# Altium schematic sheet D_INPUT.SchDoc
size A; SheetNumber: 2; SheetTotal: 5
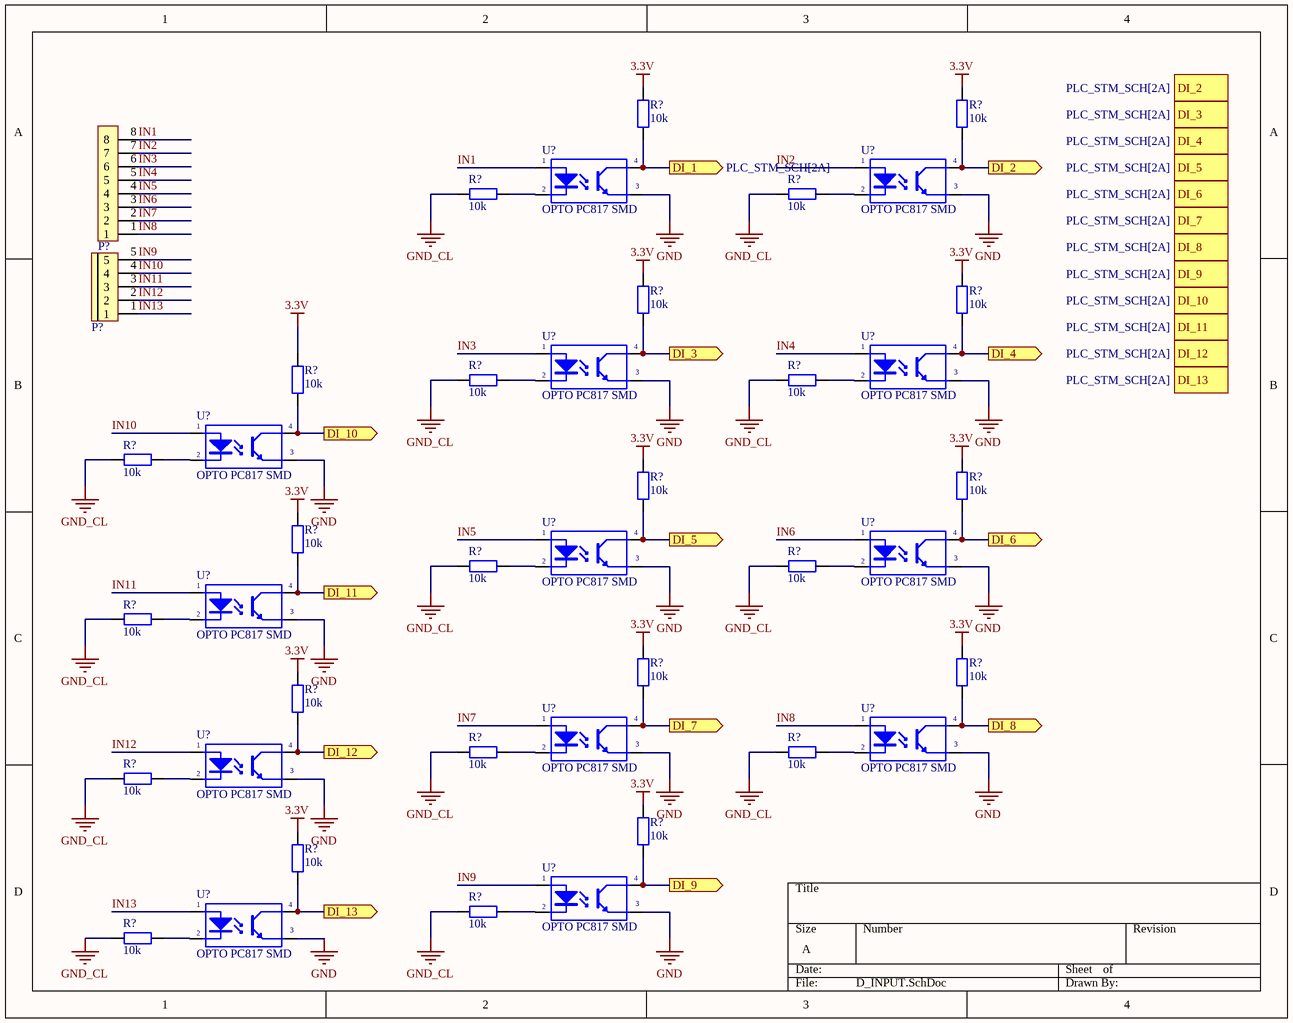
[diagram p0: D_INPUT.SchDoc]

## Parts
(Parts that share a designator on the sheet are numbered #1, #2 ... from top to bottom, then left to right.)
P?#1  CON 8 EDG5.08  [CON 8 8EDG5.08]  (value not drawn)
P?#2  CON 5 EDG5.08  [CON 5 5EDG5.08]  (value not drawn)
R?#1  10k  [tro smd 0805]
R?#2  10k  [tro smd 0805]
R?#3  10k  [tro smd 0805]
R?#4  10k  [tro smd 0805]
R?#5  10k  [tro smd 0805]
R?#6  10k  [tro smd 0805]
R?#7  10k  [tro smd 0805]
R?#8  10k  [tro smd 0805]
R?#9  10k  [tro smd 0805]
R?#10  10k  [tro smd 0805]
R?#11  10k  [tro smd 0805]
R?#12  10k  [tro smd 0805]
R?#13  10k  [tro smd 0805]
R?#14  10k  [tro smd 0805]
R?#15  10k  [tro smd 0805]
R?#16  10k  [tro smd 0805]
R?#17  10k  [tro smd 0805]
R?#18  10k  [tro smd 0805]
R?#19  10k  [tro smd 0805]
R?#20  10k  [tro smd 0805]
R?#21  10k  [tro smd 0805]
R?#22  10k  [tro smd 0805]
R?#23  10k  [tro smd 0805]
R?#24  10k  [tro smd 0805]
R?#25  10k  [tro smd 0805]
R?#26  10k  [tro smd 0805]
U?#1  OPTO PC817 SMD  [SOP4]
U?#2  OPTO PC817 SMD  [SOP4]
U?#3  OPTO PC817 SMD  [SOP4]
U?#4  OPTO PC817 SMD  [SOP4]
U?#5  OPTO PC817 SMD  [SOP4]
U?#6  OPTO PC817 SMD  [SOP4]
U?#7  OPTO PC817 SMD  [SOP4]
U?#8  OPTO PC817 SMD  [SOP4]
U?#9  OPTO PC817 SMD  [SOP4]
U?#10  OPTO PC817 SMD  [SOP4]
U?#11  OPTO PC817 SMD  [SOP4]
U?#12  OPTO PC817 SMD  [SOP4]
U?#13  OPTO PC817 SMD  [SOP4]

## Ports
DI_1 (out, see PLC_STM_SCH[2A]), DI_2 (out, see PLC_STM_SCH[2A]), DI_3 (out, see PLC_STM_SCH[2A]), DI_4 (out, see PLC_STM_SCH[2A]), DI_5 (out, see PLC_STM_SCH[2A]), DI_6 (out, see PLC_STM_SCH[2A]), DI_7 (out, see PLC_STM_SCH[2A]), DI_8 (out, see PLC_STM_SCH[2A]), DI_9 (out, see PLC_STM_SCH[2A]), DI_10 (out, see PLC_STM_SCH[2A]), DI_11 (out, see PLC_STM_SCH[2A]), DI_12 (out, see PLC_STM_SCH[2A]), DI_13 (out, see PLC_STM_SCH[2A])

## Nets
3.3V: R?#1.2 R?#2.2 R?#5.2 R?#6.2 R?#7.2 R?#11.2 R?#12.2 R?#13.2 R?#17.2 R?#18.2 R?#19.2 R?#23.2 R?#24.2
GND: U?#1.3(E) U?#2.3(E) U?#3.3(E) U?#4.3(E) U?#5.3(E) U?#6.3(E) U?#7.3(E) U?#8.3(E) U?#9.3(E) U?#10.3(E) U?#11.3(E) U?#12.3(E) U?#13.3(E)
GND_CL: R?#3.1 R?#4.1 R?#8.1 R?#9.1 R?#10.1 R?#14.1 R?#15.1 R?#16.1 R?#20.1 R?#21.1 R?#22.1 R?#25.1 R?#26.1
DI_1: R?#1.1 U?#1.4(C) ; port DI_1
DI_2: R?#2.1 U?#2.4(C) ; port DI_2
DI_3: R?#5.1 U?#3.4(C) ; port DI_3
DI_4: R?#6.1 U?#4.4(C) ; port DI_4
DI_5: R?#11.1 U?#6.4(C) ; port DI_5
DI_6: R?#12.1 U?#7.4(C) ; port DI_6
DI_7: R?#17.1 U?#9.4(C) ; port DI_7
DI_8: R?#18.1 U?#10.4(C) ; port DI_8
DI_9: R?#23.1 U?#12.4(C) ; port DI_9
DI_10: R?#7.1 U?#5.4(C) ; port DI_10
DI_11: R?#13.1 U?#8.4(C) ; port DI_11
DI_12: R?#19.1 U?#11.4(C) ; port DI_12
DI_13: R?#24.1 U?#13.4(C) ; port DI_13
IN1: P?#1.8 U?#1.1(A)
IN2: P?#1.7 U?#2.1(A)
IN3: P?#1.6 U?#3.1(A)
IN4: P?#1.5 U?#4.1(A)
IN5: P?#1.4 U?#6.1(A)
IN6: P?#1.3 U?#7.1(A)
IN7: P?#1.2 U?#9.1(A)
IN8: P?#1.1 U?#10.1(A)
IN9: P?#2.5 U?#12.1(A)
IN10: P?#2.4 U?#5.1(A)
IN11: P?#2.3 U?#8.1(A)
IN12: P?#2.2 U?#11.1(A)
IN13: P?#2.1 U?#13.1(A)
NetR?#3_2: R?#3.2 U?#1.2(K)
NetR?#4_2: R?#4.2 U?#2.2(K)
NetR?#8_2: R?#8.2 U?#3.2(K)
NetR?#9_2: R?#9.2 U?#4.2(K)
NetR?#10_2: R?#10.2 U?#5.2(K)
NetR?#14_2: R?#14.2 U?#6.2(K)
NetR?#15_2: R?#15.2 U?#7.2(K)
NetR?#16_2: R?#16.2 U?#8.2(K)
NetR?#20_2: R?#20.2 U?#9.2(K)
NetR?#21_2: R?#21.2 U?#10.2(K)
NetR?#22_2: R?#22.2 U?#11.2(K)
NetR?#25_2: R?#25.2 U?#12.2(K)
NetR?#26_2: R?#26.2 U?#13.2(K)

## Library data of the parts
P?#1 = CON 8 EDG5.08: Cắm; Ten_Linh_Kien: CON 8 2EDG5.08-8P 5.08MM ( Xanh Cong); Ma_Hang: MH000978; Don_Vi: Con; Ghi_Chu: *; Kieu_Chan: *; Chung_Loai: Cắm
P?#2 = CON 5 EDG5.08: Cắm; Ten_Linh_Kien: CON 5 2EDG5.08-5P 5.08MM ( Xanh Cong); Ma_Hang: MH003589; Kieu_Chan: *; Don_Vi: Con; Ghi_Chu: *; Chung_Loai: Cắm
R?#1-R?#26 = Tro 0805 5% 10k: Dán; Don_Vi: Con; So_Chan: 2; Ten_Linh_Kien: Trở 0805 5% 10k; Ma_Hang: MH005239; Chung_Loai: Dán; Kieu_Chan: *
U?#1-U?#13 = OPTO PC817 SMD: Single Opto; Value: PC817